# Altium schematic sheet eBox_LCD.SchDoc: eBox_LCD
size A4; DocumentNumber: 8; SheetNumber: 8; SheetTotal: 9
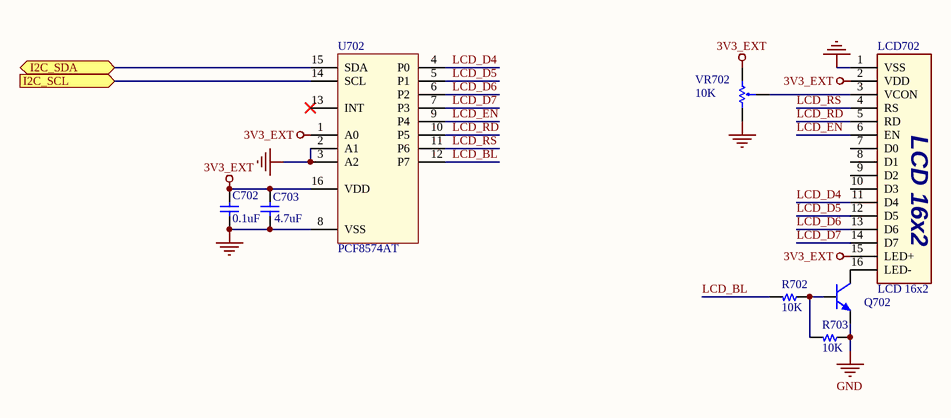
[diagram p0: eBox_LCD.SchDoc]

## Parts
C702  0.1uF  [C 0603]
C703  4.7uF  [C 0603]
LCD702  LCD 16x2  [LCD 1602A]
Q702  MMBT3904LT1G  [SOT-23]  (value not drawn)
R702  10K  [R 0603]
R703  10K  [R 0603]
U702  PCF8574AT  [SO16/PCF8574AT]
VR702  10K  [R VAR A 3D]

## Ports
I2C_SCL (in), I2C_SDA (bidir)

## Nets
3V3_EXT: C702.1 C703.1 LCD702.2(VDD) LCD702.15(LED+) U702.1(A0) U702.16(VDD) VR702.1
GND: C702.2 C703.2 LCD702.1(VSS) Q702.2(E) R703.1 U702.2(A1) U702.3(A2) U702.8(VSS) VR702.3
I2C_SCL: U702.14(SCL) ; port I2C_SCL
I2C_SDA: U702.15(SDA) ; port I2C_SDA
LCD_BL: R702.2 U702.12(P7)
LCD_D4: LCD702.11(D4) U702.4(P0)
LCD_D5: LCD702.12(D5) U702.5(P1)
LCD_D6: LCD702.13(D6) U702.6(P2)
LCD_D7: LCD702.14(D7) U702.7(P3)
LCD_EN: LCD702.6(EN) U702.9(P4)
LCD_RD: LCD702.5(RD) U702.10(P5)
LCD_RS: LCD702.4(RS) U702.11(P6)
NetLCD702_3: LCD702.3(VCON) VR702.2
NetLCD702_16: LCD702.16(LED-) Q702.3(C)
NetQ702_1: Q702.1(B) R702.1 R703.2

Not connected (* = marked no-connect by the designer): LCD702 7(D0) 8(D1) 9(D2) 10(D3); U702 13(INT)*

## Notes on the sheet
- Title
- Size:
- Date:
- A4
- Number:
- Time:
- Revision:
- Sheet
- of
- NPN
- Lab
- File:

## Library data of the parts
C702 = Capacitor NP: CAP CER 0.1UF 50V X7R 0603; TYPE: SMD; PACKAGE: SMD0603; STOCK CODE: CC0603KRX7R9BB104; SUPPLIER: tme.vn; STOCK DESC: 100nF/50V ±10% X7R SMD-0603 Capacitor; UNIT PRICE: 400
C703 = Capacitor NP: CAP CER 4.7UF 50V X7R 0603; TYPE: SMD; PACKAGE: SMD0603; STOCK CODE: CC0603KRX5R6BB475; SUPPLIER: tme.vn; STOCK DESC: 4.7uF 10V ±10% X5R SMD-0603 Capacitor; UNIT PRICE: 600
LCD702 = LCD 16x2: Character LCD 16x2
Q702 = Transistor NPN: TRANS NPN 40V 0.2A SOT23; TYPE: SMD; STOCK CODE: LMBT3904LT1G; SUPPLIER: tme.vn; STOCK DESC: NPN General-Purpose Amplifier SMD Transistor; UNIT PRICE: 600
R702 R703 = Resistor: RES SMD 10K OHM 1% 1/10W 0603; PACKAGE: SMD0603; STOCK CODE: RM06JTN103; SUPPLIER: tme.vn; TYPE: SMD; STOCK DESC: 10K ±5% SMD-0603 Resistor; UNIT PRICE: 50
U702 = PCF8574AT: Remote 8-bit I/O expander for I2C-bus with interrupt; PART NO: PCF8574AT/3; BRAND: NXP; PACKAGE: SO16; SUPPLIER: CHINA; TYPE: SMD; UNIT PRICE: 6160
VR702 = Resistor Variable: TRIMMER 10K OHM 0.5W PC PIN; PACKAGE: DIP3; STOCK CODE: 3362P-1-103LF; SUPPLIER: tme.vn; TYPE: TH; STOCK DESC: TRIMMER 10K OHM 0.5W PC PIN; UNIT PRICE: 7000